# EAGLE schematic mini-meter-reva (EAGLE 6.5.0)
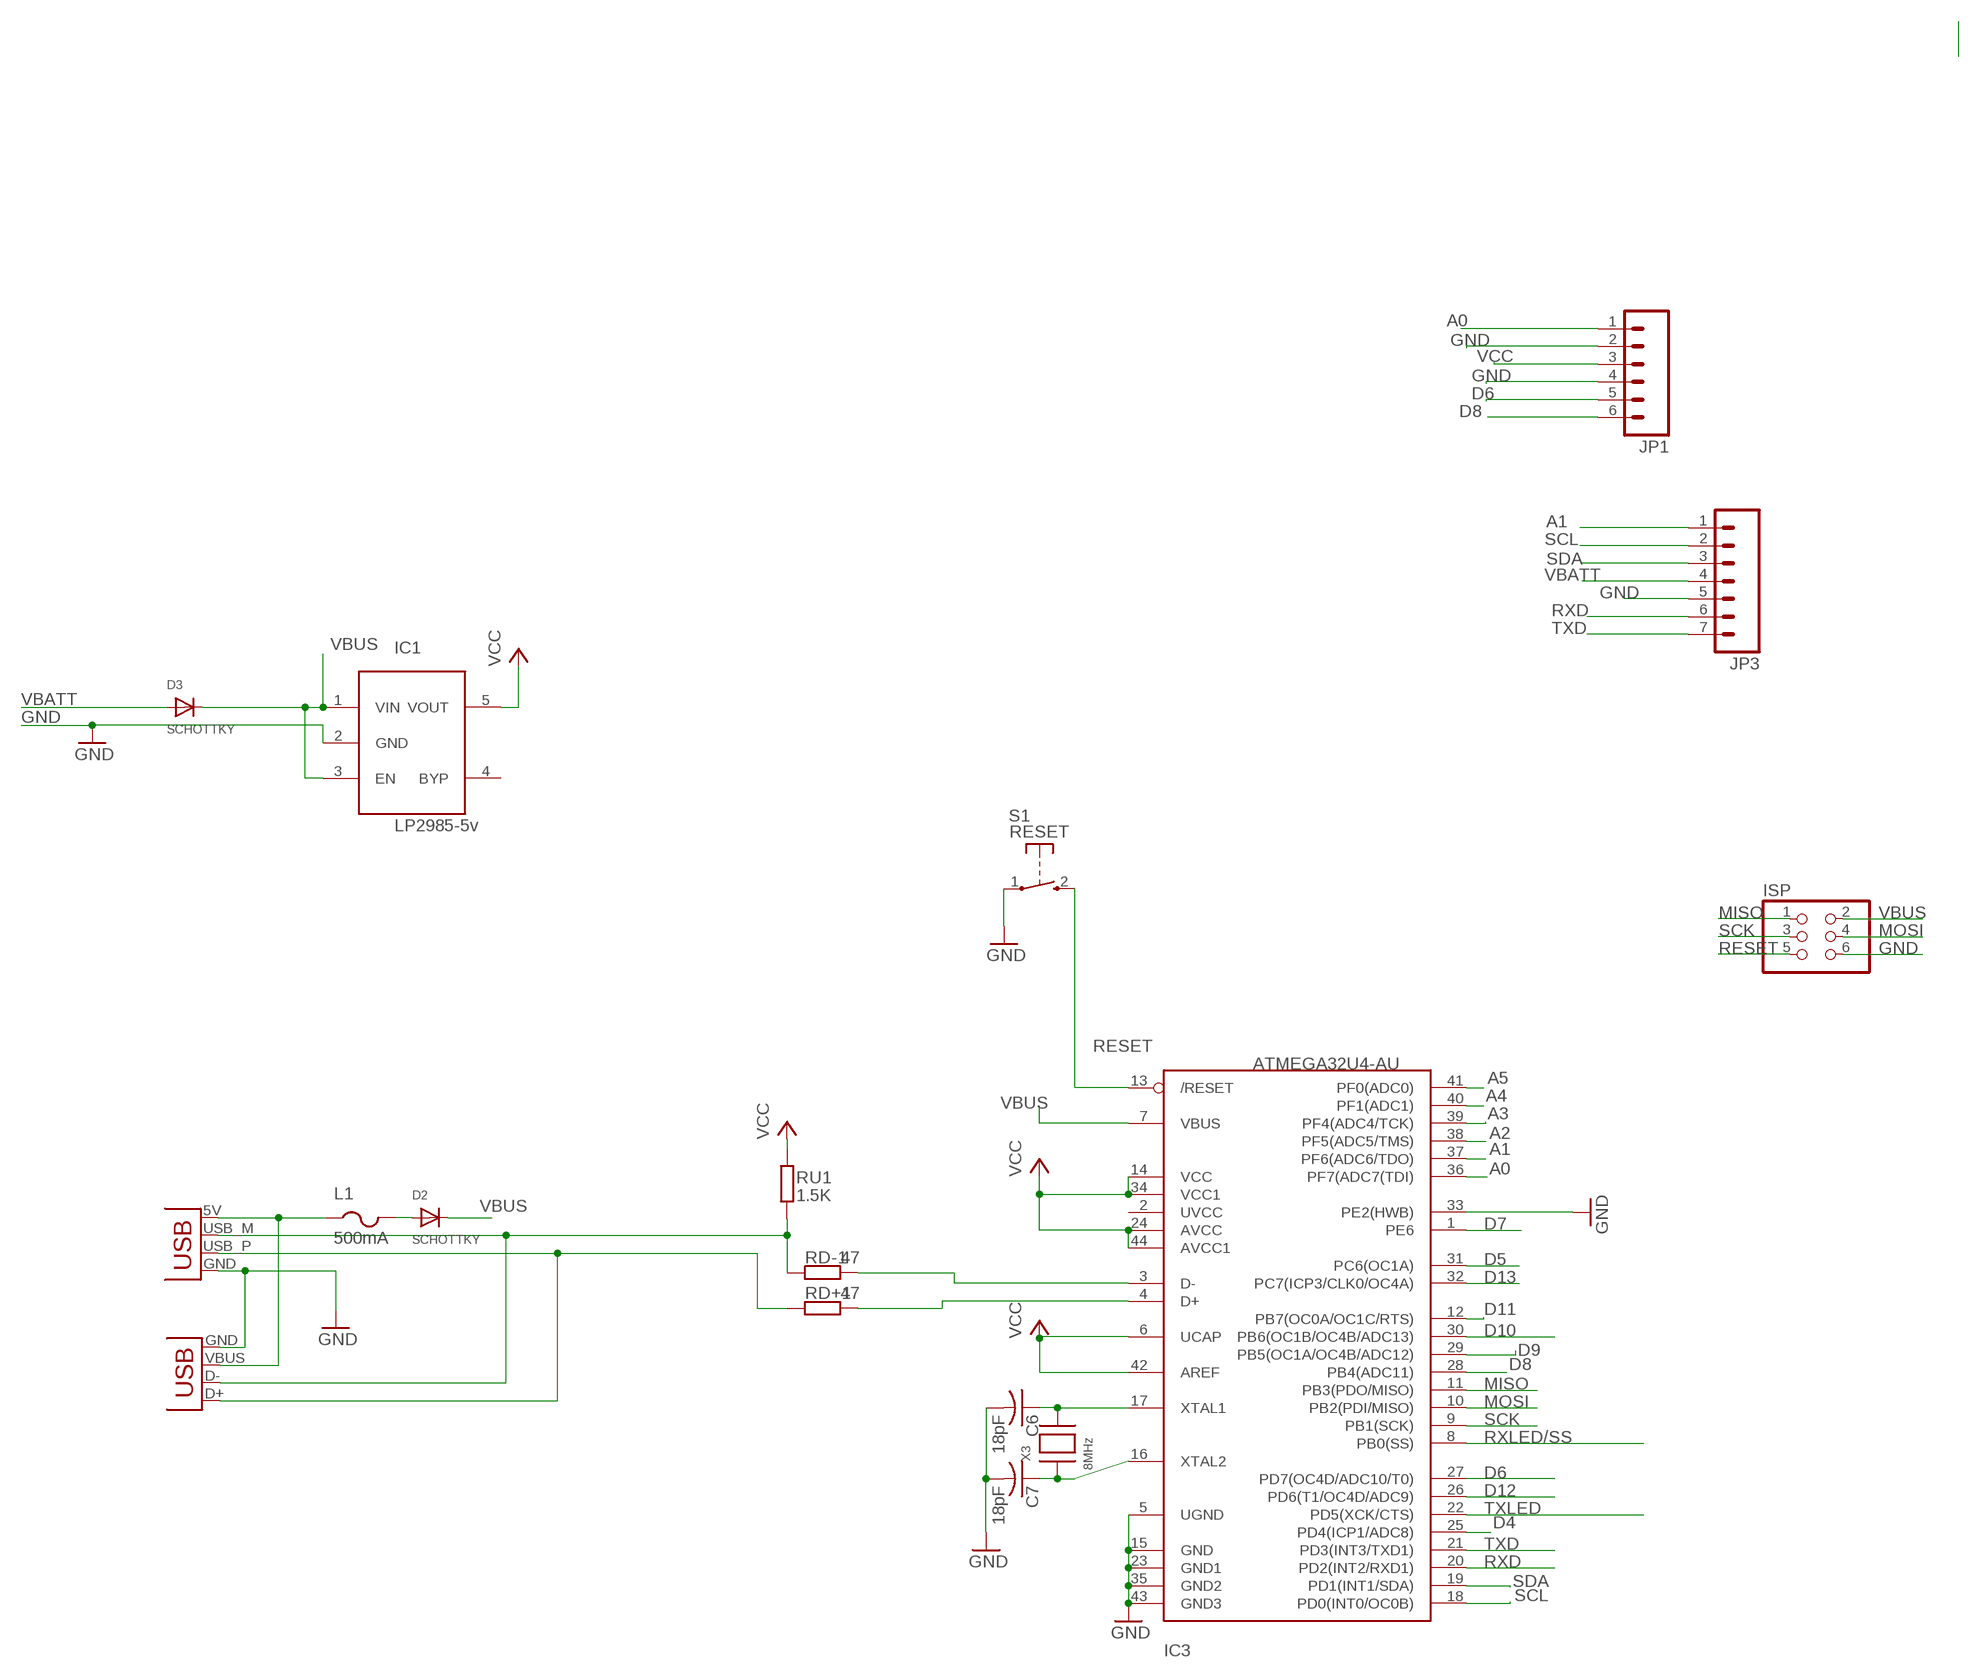
[diagram p0: schematic, sheet 1]

## Parts
C6  18pF  C-USC0805K  [C0805K]
C7  18pF  C-USC0805K  [C0805K]
D2  SCHOTTKY  DIODESOD-123  [SOD-123]
D3  SCHOTTKY  DIODESOD-123  [SOD-123]
IC1  LP2985-5v  LP298XS  [SOT23-5L]
IC3  ATMEGA32U4-AU  [TQFP44]
ISP  PINHD-2X3  [2X03]
JP1  M06LOCK  [1X06_LOCK]
JP3  M07LOCK  [1X07_LOCK]
L1  500mA  PTCFUSE-1206  [R1206]
P1  USBPCB  [USB-A-PCB]
RD+1  47  R-EU_R0805  [R0805]
RD-1  47  R-EU_R0805  [R0805]
RU1  1.5K  R-EU_R0805  [R0805]
S1  RESET  TAC_SWITCH_2PIN  [TACTILE_SWITCH_SMD_2PIN_TINY]
X2  USBSMD  [USB-MINIB]
X3  8MHz  XTALNX5032  [NX5032]

## Nets
A0: IC3.36(PF7(ADC7(TDI)) JP1.1
A1: IC3.37(PF6(ADC6/TDO)) JP3.1
A2: IC3.38(PF5(ADC5/TMS))
A3: IC3.39(PF4(ADC4/TCK))
A4: IC3.40(PF1(ADC1))
A5: IC3.41(PF0(ADC0))
D4: IC3.25(PD4(ICP1/ADC8))
D5: IC3.31(PC6(OC1A))
D6: IC3.27(PD7(OC4D/ADC10/T0)) JP1.5
D7: IC3.1(PE6)
D8: IC3.28(PB4(ADC11)) JP1.6
D9: IC3.29(PB5(OC1A/OC4B/ADC12))
D10: IC3.30(PB6(OC1B/OC4B/ADC13))
D11: IC3.12(PB7(OC0A/OC1C/RTS))
D12: IC3.26(PD6(T1/OC4D/ADC9))
D13: IC3.32(PC7(ICP3/CLK0/OC4A))
D-: P1.USB_M(D-) RD-1.1 RU1.1 X2.D-
GND: C6.2 C7.2 IC1.2(GND) IC3.5(UGND) IC3.15(GND) IC3.23(GND1) IC3.33(PE2(HWB)) IC3.35(GND2) IC3.43(GND3) ISP.6 JP1.2 JP1.4 JP3.5 P1.GND S1.1(P) X2.GND
MISO: IC3.11(PB3(PDO/MISO)) ISP.1
MOSI: IC3.10(PB2(PDI/MISO)) ISP.4
N$1: D2.A L1.2
N$2: C7.1 IC3.16(XTAL2) X3.P$1
N$3: C6.1 IC3.17(XTAL1) X3.P$2
N$4: P1.USB_P(D+) RD+1.1 X2.D+
N$21: IC3.4(D+) RD+1.2
N$22: IC3.3(D-) RD-1.2
RESET: IC3.13(/RESET) ISP.5 S1.2(S)
RXD: IC3.20(PD2(INT2/RXD1)) JP3.6
RXLED/SS: IC3.8(PB0(SS))
SCK: IC3.9(PB1(SCK)) ISP.3
SCL: IC3.18(PD0(INT0/OC0B)) JP3.2
SDA: IC3.19(PD1(INT1/SDA)) JP3.3
TXD: IC3.21(PD3(INT3/TXD1)) JP3.7
TXLED: IC3.22(PD5(XCK/CTS))
VBATT: D3.A JP3.4
VBUS: D2.C D3.C IC1.1(VIN) IC1.3(EN) IC3.7(VBUS) ISP.2
VBUS1: L1.1 P1.5V(VBUS) X2.VBUS
VCC: IC1.5(VOUT) IC3.6(UCAP) IC3.14(VCC) IC3.24(AVCC) IC3.34(VCC1) IC3.42(AREF) IC3.44(AVCC1) JP1.3 RU1.2
Unconnected: IC1.4(BYP) IC3.2(UVCC)

## Library data of the parts
C6 C7 = adafruit:C-US: CAPACITOR, American symbol
D2 D3 = adafruit:DIODE: Diode SMADIODE - SMA Surface Mount Package 20V 1A Schottky Diode Digikey: 641-1014-6-ND DO-1N4148 - Through Hole Small Current Diode SOD-123 20V 1 A (.5mV Vf) Schottky Diode - Digikey: MBRX120TPMSCT-ND SOD-323 10V 570mA (.38mV Vf, 3ns) Schottky Diode - Digikey: ZLLS410CT-ND SOD-523 30V 30mA Schottky Diode (RB751S-40TE61) - Digikey: RB751S-40TE61CT-ND SOT23-R/W - SOT23 Package (R = Solder Paste/Reflow Ovens, W = Hand-Soldering) BAT54Film 40V 300mA - Digikey: 497-7162-1-ND
IC1 = adafruit:LP298X
IC3 = adaprog:ATMEGA32U4
ISP = pinhead:PINHD-2X3: PIN HEADER
JP1 = SparkFun-Connectors:M06: Header 6 Standard 6-pin 0.1" header. Use with straight break away headers (SKU : PRT-00116), right angle break away headers (PRT-00553), swiss pins (PRT-00743), machine pins (PRT-00117), and female headers (PRT-00115). Molex polarized connector foot print use with SKU : PRT-08094 with associated crimp pins and housings. NOTES ON THE VARIANTS LOCK and LOCK_LONGPADS... This footprint was designed to help hold the alignment of a through-hole component (i.e. 6-pin header) while soldering it into place. You may notice that each hole has been shifted either up or down by 0.005 of an inch from it's more standard position (which is a perfectly straight line). This slight alteration caused the pins (the squares in the middle) to touch the edges of the holes. Because they are alternating, it causes a "brace" to hold the component in place. 0.005 has proven to be the perfect amount of "off-center" position when using our standard breakaway headers. Although looks a little odd when you look at the bare footprint, once you have a header in there, the alteration is very hard to notice. Also,if you push a header all the way into place, it is covered up entirely on the bottom side. This idea of altering the position of holes to aid alignment will be further integrated into the Sparkfun Library for other footprints. It can help hold any component with 3 or more connection pins.
JP3 = SparkFun-Connectors:M07: Header 7 Standard 7-pin 0.1" header. Use with straight break away headers (SKU : PRT-00116), right angle break away headers (PRT-00553), swiss pins (PRT-00743), machine pins (PRT-00117), and female headers (PRT-00115). NOTES ON THE VARIANTS LOCK and LOCK_LONGPADS... This footprint was designed to help hold the alignment of a through-hole component (i.e. 7-pin header) while soldering it into place. You may notice that each hole has been shifted either up or down by 0.005 of an inch from it's more standard position (which is usually a perfectly straight line). This slight alteration caused the pins (the squares in the middle) to touch the edges of the holes. Because they are alternating, it causes a "brace" to hold the header in place. 0.005 has proven to be the perfect amount of "off-center" position when using our standard breakaway headers. Although looks a little odd when you look at the bare footprint, once you have a header in there, the alteration is very hard to notice. Also, if you push a header all the way into place, it is covered up entirely on the bottom side. This idea of altering the position of holes to aid alignment will be further integrated into the Sparkfun Library for other footprints. It can help hold any component with 3 or more connection pins.
L1 = adafruit:PTCFUSE: PTC fuses, resettable thermistors
P1 = freetronics-master-v1:USB: USB Connectors USB-B-PTH is fully proven SKU : PRT-00139 USB-miniB is fully proven SKU : PRT-00587 USB-A-PCB is untested. USB-A-H is throughly reviewed, but untested. Spark Fun Electronics SKU : PRT-00437 USB-B-SMT is throughly reviewed, but untested. Needs silkscreen touching up. USB-A-S has not been used/tested USB-MB-H has not been used/tested
RD+1 RD-1 RU1 = rcl:R-EU_: RESISTOR, European symbol
S1 = freetronics-master-v1:TAC_SWITCH_2PIN: Momentary Tactile Switch - 2 pin
X2 = SparkFun:USB: USB Connectors USB-B-PTH is fully proven SKU : PRT-00139 USB-miniB is fully proven SKU : PRT-00587 USB-A-PCB is untested. USB-A-H is throughly reviewed, but untested. Spark Fun Electronics SKU : PRT-00437 USB-B-SMT is throughly reviewed, but untested. Needs silkscreen touching up. USB-A-S has not been used/tested USB-MB-H has not been used/tested
X3 = adaprog:XTAL

## Net classes
0 default: width 0.152 mm, drill 0.241 mm, clearance 0.152 mm
1 power: width 0.813 mm, clearance 0.203 mm